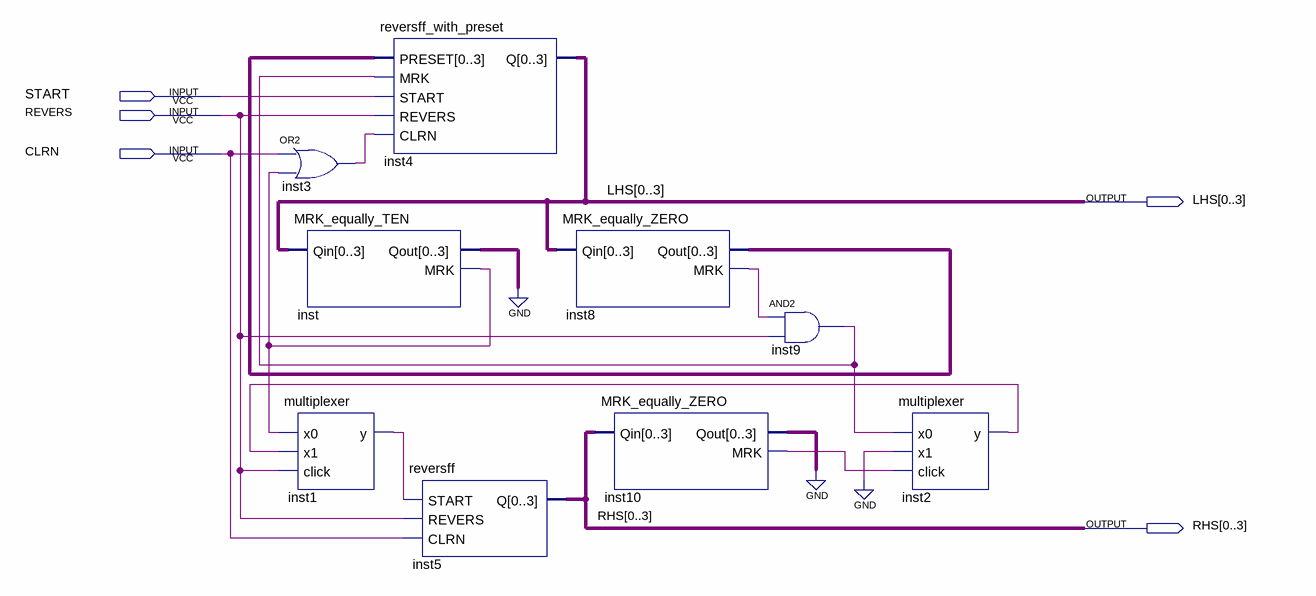
[diagram p0: schematic sheet]
// Quartus schematic CNT.bdf as structural Verilog: 9 symbols, 5 pins
module CNT (
  input  START,
  input  REVERS,
  input  CLRN,
  output [0:3] LHS,
  output [0:3] RHS
);

  wire inst1_y, inst2_y, inst3_out, inst8_mrk, inst9_out, inst10_mrk, inst_mrk;
  wire [3:0] inst8_qout, inst10_qout, inst_qout;

  or inst3 (inst3_out, CLRN, inst_mrk);
  multiplexer inst1 (.x0(inst_mrk), .x1(inst2_y), .click(REVERS), .y(inst1_y));
  MRK_equally_TEN inst (.Qin(LHS), .Qout(inst_qout), .MRK(inst_mrk));
  reversff_with_preset inst4 (
    .PRESET(inst8_qout), .MRK(inst9_out), .START(START), .REVERS(REVERS), .CLRN(inst3_out), .Q(LHS));
  reversff inst5 (.START(inst1_y), .REVERS(REVERS), .CLRN(CLRN), .Q(RHS));
  MRK_equally_ZERO inst8 (.Qin(LHS), .Qout(inst8_qout), .MRK(inst8_mrk));
  MRK_equally_ZERO inst10 (.Qin(RHS), .Qout(inst10_qout), .MRK(inst10_mrk));
  and inst9 (inst9_out, inst8_mrk, REVERS);
  multiplexer inst2 (.x0(inst9_out), .x1(1'b0), .click(inst10_mrk), .y(inst2_y));
  // also tied to GND on the sheet: {inst_qout[0], inst_qout[1], inst_qout[2], inst_qout[3], inst10_qout[0], inst10_qout[1], inst10_qout[2], inst10_qout[3]}
endmodule
